# EAGLE schematic Serial_CAN_Bus (EAGLE 6.4)
DESCRIPTION: microOBD 200 OBD-II Module; HW_REV: 1.4; PCB_REV: C; PCB_SPEC1: Layer Count: 4; PCB_SPEC2: Size: 1.3" x 0.59"; PCB_SPEC3: Finish Thickness: 0.049" - 0.052"; PCB_SPEC4: Copper Weight: 1oz; TITLE: STM1120

## Sheet 1 of 2
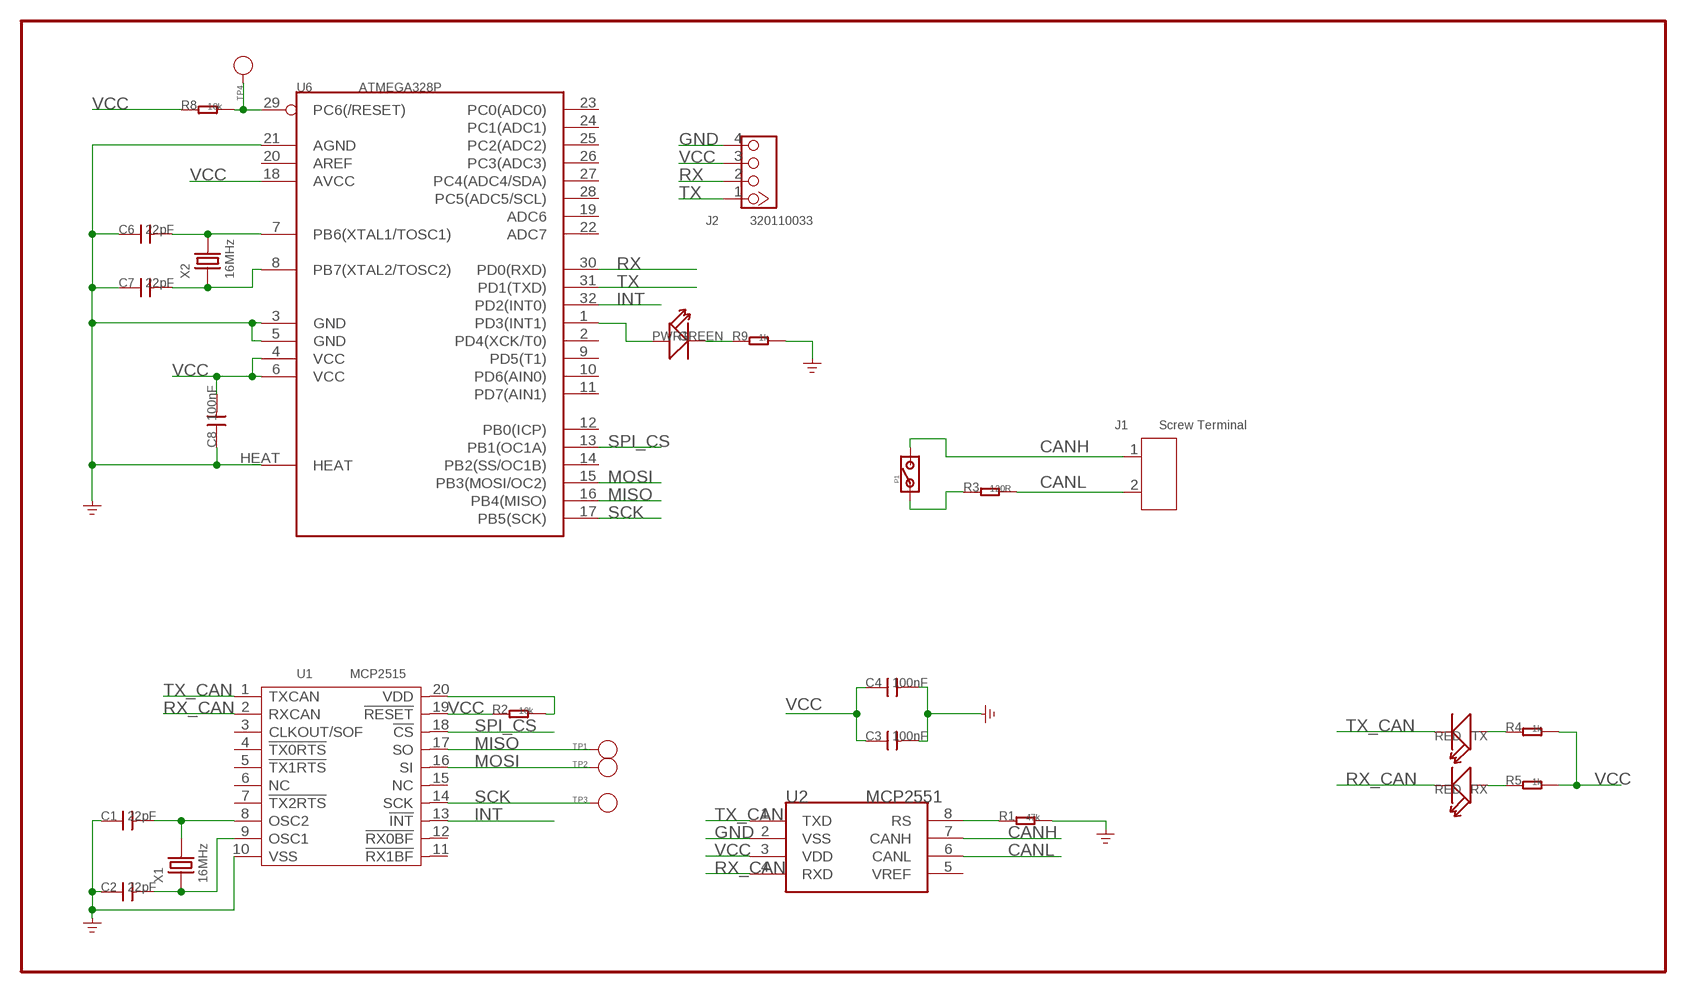
[diagram p0: schematic, sheet 1]

### Parts
C1  22pF  C-0603  [0603]
C2  22pF  C-0603  [0603]
C3  100nF  C-0603  [0603]
C4  100nF  C-0603  [0603]
C6  22pF  C-0603  [0603]
C7  22pF  C-0603  [0603]
C8  100nF  C-0603  [0603]
J1  Screw Terminal  SCREW-TERMINAL-2P'3.5'  [2P-3.5]
J2  320110033  GROVE-CONNECTOR-DIP-2.0  [HW4-2.0]
P1  PAD-JUMPER-2P  [2P-SMD-1.78X1.27]
PWR1  GREEN  LED'0603'  [LED-0603]
R1  47k  R-0603  [0603]
R2  10k  R-0603  [0603]
R3  120R  R-0603  [0603]
R4  1k  R-0603  [0603]
R5  1k  R-0603  [0603]
R8  10k  R-0603  [0603]
R9  1k  R-0603  [0603]
RX  RED  LED'0603'  [LED-0603]
TP1  PAD-TEST-POINT'4545'  [TP_4545]
TP2  PAD-TEST-POINT'4545'  [TP_4545]
TP3  PAD-TEST-POINT'4545'  [TP_4545]
TP4  PAD-TEST-POINT'4545'  [TP_4545]
TX  RED  LED'0603'  [LED-0603]
U1  MCP2515  MCP2515'ST'  [TSSOP20-0.65-6.5X4.4MM]
U2  MCP2551  MCP2551-SOIC8  [SOIC8-6.0]
U6  ATMEGA328P  MEGA8  [MLF32X]
X1  16MHz  CRYSTAL-2P'5032'  [X2-SMD-5.0X3.2X1.3MM]
X2  16MHz  CRYSTAL-2P'5032'  [X2-SMD-5.0X3.2X1.3MM]

### Nets
CANH: J1.1 P1.2 U2.7(CANH)
CANL: J1.2 R3.2 U2.6(CANL)
GND: C1.1 C2.1 C3.2 C4.2 C6.1 C7.1 C8.1 J2.4 R1.2 R9.2 U1.10(VSS) U2.2(VSS) U6.3(GND) U6.5(GND) U6.21(AGND) U6.HEAT
INT: U1.13(!INT) U6.32(PD2(INT0))
MISO: TP1.T U1.17(SO) U6.16(PB4(MISO))
MOSI: TP2.T U1.16(SI) U6.15(PB3(MOSI/OC2))
N$1: P1.1 R3.1
N$2: R4.1 TX.+
N$3: C6.2 U6.7(PB6(XTAL1/TOSC1)) X2.2
N$4: C7.2 U6.8(PB7(XTAL2/TOSC2)) X2.1
N$5: R8.2 TP4.T U6.29(PC6(/RESET))
N$6: PWR1.+ U6.1(PD3(INT1))
N$7: PWR1.- R9.1
N$15: R5.1 RX.+
N$16: C1.2 U1.8(OSC2) X1.2
N$17: C2.2 U1.9(OSC1) X1.1
N$20: R1.1 U2.8(RS)
RST_N: R2.1 U1.19(!RESET)
RX: J2.2 U6.30(PD0(RXD))
RX_CAN: RX.- U1.2(RXCAN) U2.4(RXD)
SCK: TP3.T U1.14(SCK) U6.17(PB5(SCK))
SPI_CS: U1.18(!CS) U6.13(PB1(OC1A))
TX: J2.1 U6.31(PD1(TXD))
TX_CAN: TX.- U1.1(TXCAN) U2.1(TXD)
VCC: C3.1 C4.1 C8.2 J2.3 R2.2 R4.2 R5.2 R8.1 U1.20(VDD) U2.3(VDD) U6.4(VCC) U6.6(VCC) U6.18(AVCC)
Unconnected: U1.3(CLKOUT/SOF) U1.4(!TX0RTS) U1.5(!TX1RTS) U1.6(NC) U1.7(!TX2RTS) U1.11(!RX1BF) U1.12(!RX0BF) U1.15(NC) U2.5(VREF) U6.2(PD4(XCK/T0)) U6.9(PD5(T1)) U6.10(PD6(AIN0)) U6.11(PD7(AIN1)) U6.12(PB0(ICP)) U6.14(PB2(SS/OC1B)) U6.19(ADC6) U6.20(AREF) U6.22(ADC7) U6.23(PC0(ADC0)) U6.24(PC1(ADC1)) U6.25(PC2(ADC2)) U6.26(PC3(ADC3)) U6.27(PC4(ADC4/SDA)) U6.28(PC5(ADC5/SCL))

## Sheet 2 of 2

## Library data of the parts
C1-C4 C6-C8 = Discrete:C*: Ceramic Capacitors
J1 = Connector-new:SCREW-TERMINAL-2P: 2P-3.5:320110028;2P-5.0:320110031
J2 = Connector-new:GROVE-CONNECTOR-DIP: 4P-2.0:320110033;4P-2.0-90D:320110034
P1 = Discrete:PAD-JUMPER-2P
PWR1 RX TX = Discrete:LED*
R1-R5 R8 R9 = Discrete:R*
TP1-TP4 = Discrete:PAD-TEST-POINT; PARTNO: DNP
U1 = Heilight:MCP2515
U2 = IC:MCP2551: High-Speed CAN Transceiver http://ww1.microchip.com/downloads/en/devicedoc/21667f.pdf
U6 = ICs_v54:MEGA8
X1 X2 = Discrete-new:CRYSTAL-2P

## Net classes
0 default: width 0.152 mm, clearance 0.152 mm
3 usbvcc: width 0.152 mm, drill 0.152 mm, clearance 0.152 mm